# EAGLE design PL-100 (EAGLE 7.6.0)
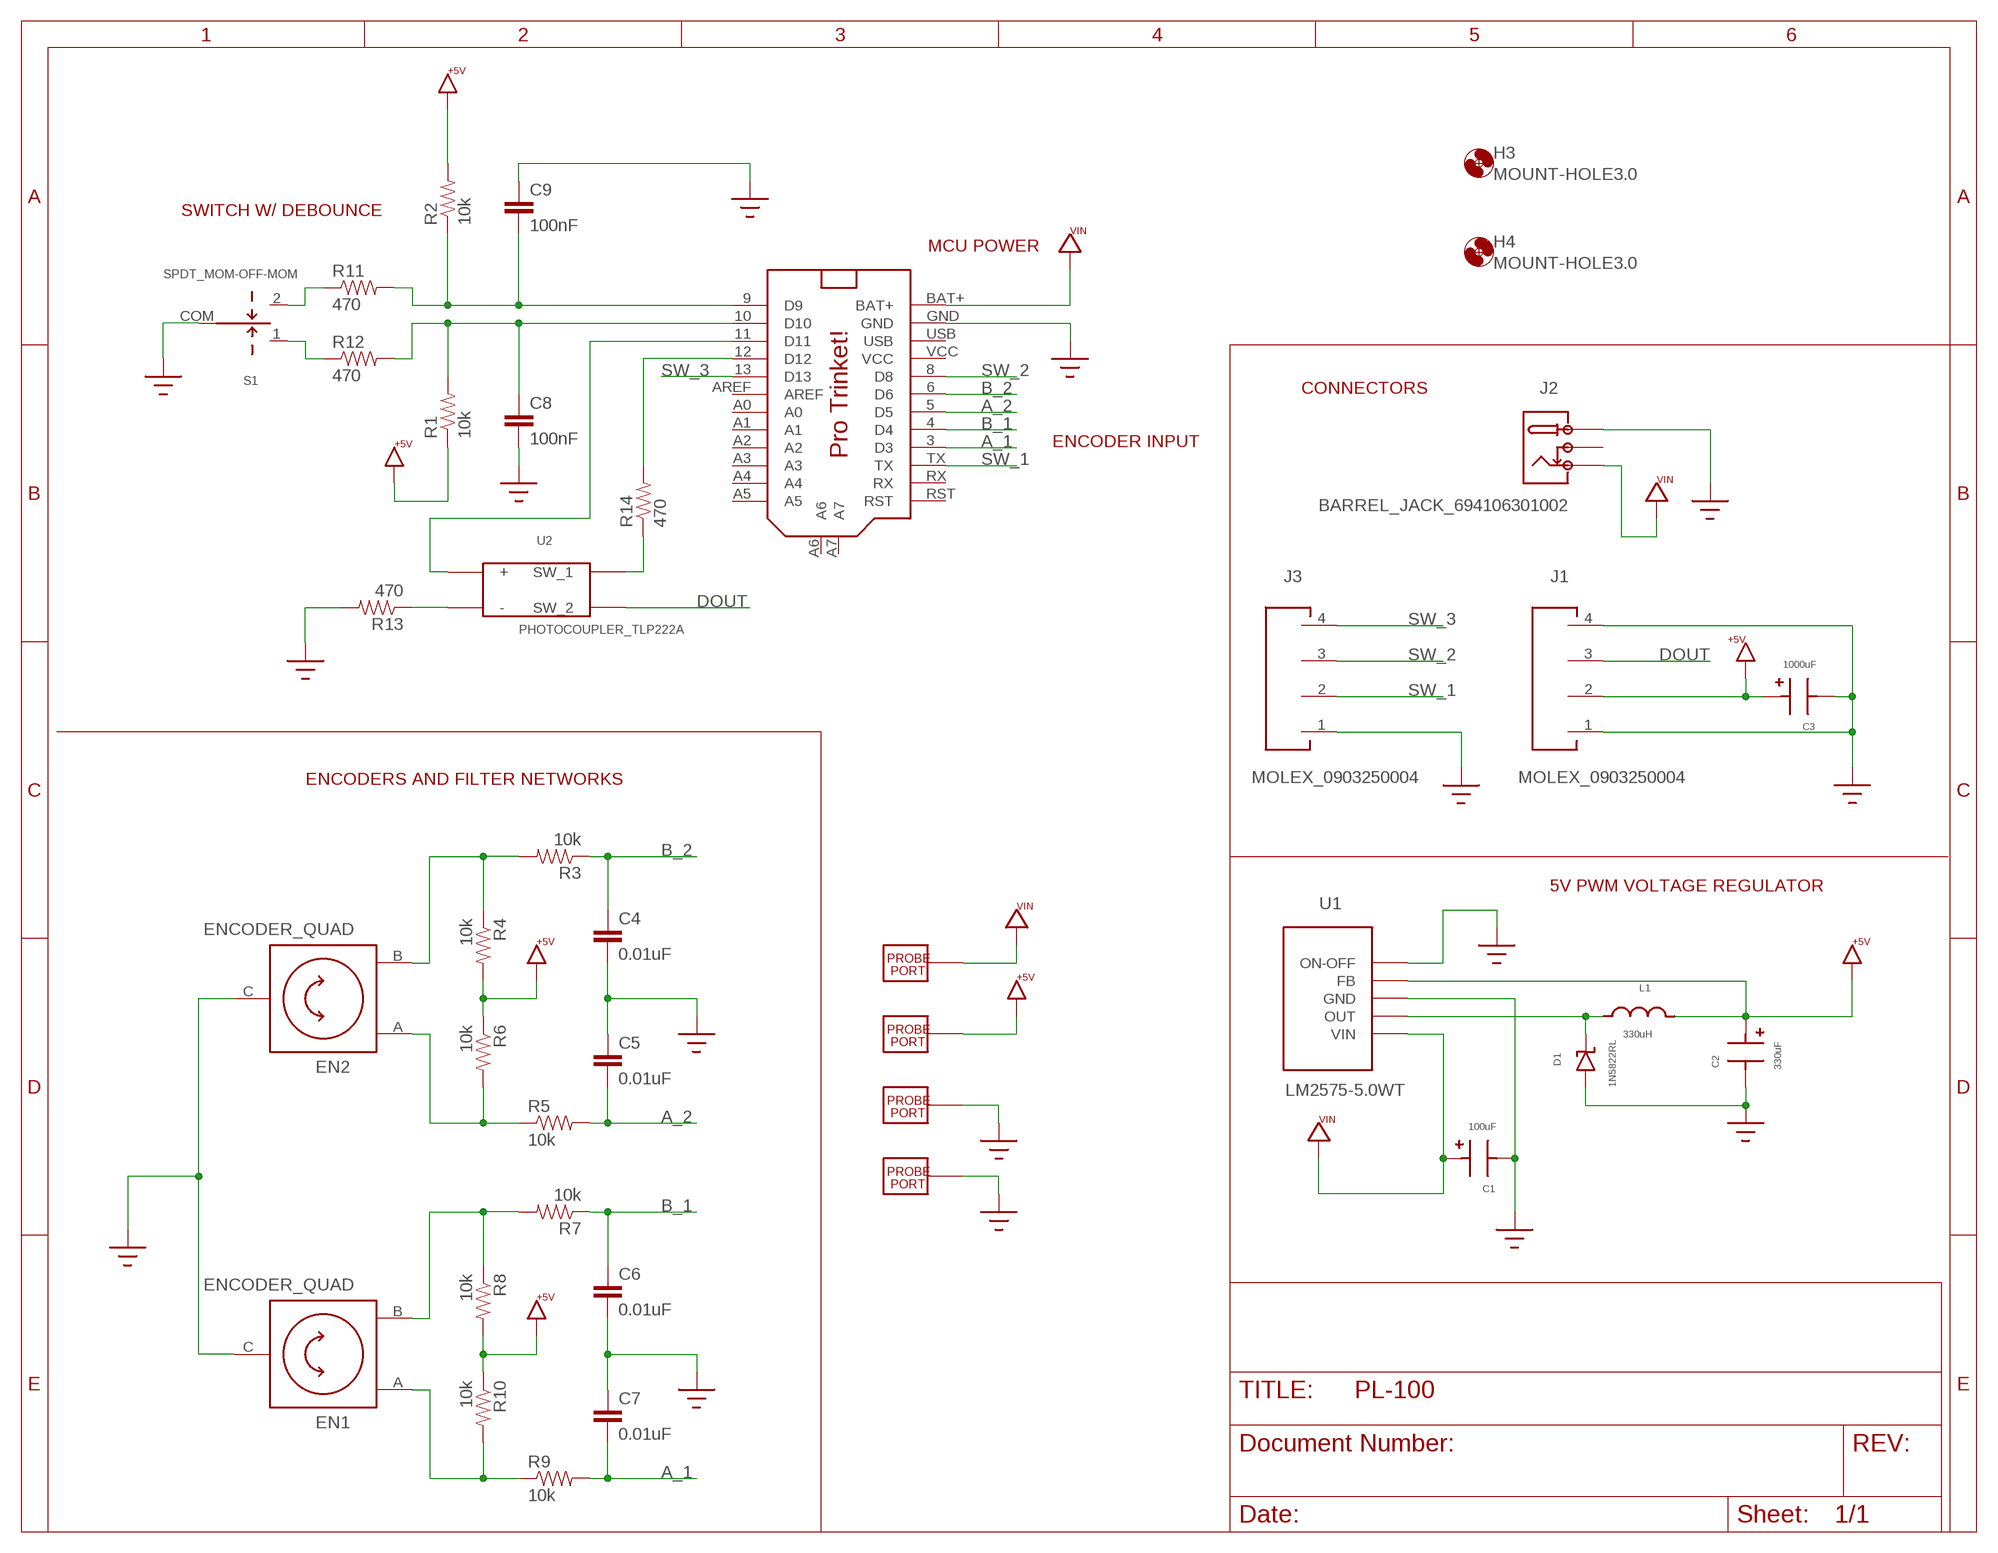
[diagram p0: schematic, sheet 1]

## Parts
+5V  PROBE_PORT  [PROBE_PORT]
C1  100uF  CAP_POL6.3-DIA_2.5-SPACE  [RADIAL_POL_6.3-DIA_2.5-SPACE]
C2  330uF  CAP_POL8-DIA_3.5-SPACE  [RADIAL_POL_8-DIA_3.5-SPACE]
C3  1000uF  CAP_POL10-DIA_5-SPACE  [RADIAL_POL_10-DIA_5-SPACE]
C4  0.01uF  CAPEZ  [CAP-PTH-SMALLEZ]
C5  0.01uF  CAPEZ  [CAP-PTH-SMALLEZ]
C6  0.01uF  CAPEZ  [CAP-PTH-SMALLEZ]
C7  0.01uF  CAPEZ  [CAP-PTH-SMALLEZ]
C8  100nF  CAPPTH  [CAP-PTH-SMALL]
C9  100nF  CAPPTH  [CAP-PTH-SMALL]
D1  1N5822RL  DIODE_SHOTTKY  [DO-201AD_AXIAL]
EN1  ENCODER_QUAD  [PEC11R-4015F-N0024]
EN2  ENCODER_QUAD  [PEC11R-4015F-N0024]
GND1  PROBE_PORT  [PROBE_PORT]
GND2  PROBE_PORT  [PROBE_PORT]
H3  MOUNT-HOLE3.0  [3,0]
H4  MOUNT-HOLE3.0  [3,0]
J1  MOLEX_0903250004  [0903250004]
J2  BARREL_JACK_694106301002  [BARREL_JACK_694106301002]
J3  MOLEX_0903250004  [0903250004]
L1  330uH  INDUCTOR  [INDUCT_AXIAL_28-SPACING]
R1  10k  RESISTORPTH-1/4W  [AXIAL-0.4]
R2  10k  RESISTORPTH-1/4W  [AXIAL-0.4]
R3  10k  RESISTORPTH-1/4W  [AXIAL-0.4]
R4  10k  RESISTORPTH-1/4W  [AXIAL-0.4]
R5  10k  RESISTORPTH-1/4W  [AXIAL-0.4]
R6  10k  RESISTORPTH-1/4W  [AXIAL-0.4]
R7  10k  RESISTORPTH-1/4W  [AXIAL-0.4]
R8  10k  RESISTORPTH-1/4W  [AXIAL-0.4]
R9  10k  RESISTORPTH-1/4W  [AXIAL-0.4]
R10  10k  RESISTORPTH-1/4W  [AXIAL-0.4]
R11  470  RESISTORPTH-1/4W  [AXIAL-0.4]
R12  470  RESISTORPTH-1/4W  [AXIAL-0.4]
R13  470  RESISTORPTH-1/4W  [AXIAL-0.4]
R14  470  RESISTORPTH-1/4W  [AXIAL-0.4]
S1  SPDT_MOM-OFF-MOM  [100SP4T6B11M2QEH]
U1  LM2575-5.0WT  [TO-220-5]
U2  PHOTOCOUPLER_TLP222A  [DIP-4]
U$2  PRO_TRINKET  [PROTRINKET]
VIN  PROBE_PORT  [PROBE_PORT]

## Nets
+5V: +5V.P$1 C2.+ C3.+ J1.2 L1.2 R1.P$1 R2.P$2 R4.P$2 R6.P$1 R8.P$2 R10.P$1 U1.4(FB)
A_1: C7.2 R9.P$2 U$2.3(D3)
A_2: C5.2 R5.P$2 U$2.5(D5)
B_1: C6.1 R7.P$1 U$2.4(D4)
B_2: C4.1 R3.P$1 U$2.6(D6)
DOUT: J1.3 U2.4(SW_2)
GND: C1.- C2.- C3.- C4.2 C5.1 C6.2 C7.1 C8.2 C9.1 D1.+ EN1.C EN2.C GND1.P$1 GND2.P$1 J1.1 J1.4 J2.1 J3.1 R13.P$2 S1.COM U1.3(GND) U1.5(ON-OFF) U$2.GND
N$1: D1.- L1.1 U1.2(OUT)
N$2: C9.2 R2.P$1 R11.P$2 U$2.9(D9)
N$3: C8.1 R1.P$2 R12.P$2 U$2.10(D10)
N$4: EN2.B R3.P$2 R4.P$1
N$5: EN2.A R5.P$1 R6.P$2
N$6: EN1.B R7.P$2 R8.P$1
N$7: EN1.A R9.P$1 R10.P$2
N$8: R11.P$1 S1.2(MOM_2)
N$9: R12.P$1 S1.1(MOM_1)
N$10: R13.P$1 U2.2(-)
N$11: R14.P$2 U$2.12(D12)
N$12: R14.P$1 U2.3(SW_1)
N$13: U2.1(+) U$2.11(D11)
SW_1: J3.2 U$2.TX
SW_2: J3.3 U$2.8(D8)
SW_3: J3.4 U$2.13(D13)
VIN: C1.+ J2.2 U1.1(VIN) U$2.BAT+ VIN.P$1
Unconnected: U$2.A0 U$2.A1 U$2.A2 U$2.A3 U$2.A4 U$2.A5 U$2.A6 U$2.A7 U$2.AREF U$2.RST U$2.RX

## Notes on the sheet
- SWITCH W/ DEBOUNCE
- MCU POWER
- CONNECTORS
- ENCODER INPUT
- ENCODERS AND FILTER NETWORKS
- 5V PWM VOLTAGE REGULATOR

## Power pins joined to a net without a drawn wire
3: J2.3
USB: U$2.USB
VCC: U$2.VCC

## Library data of the parts
+5V GND1 GND2 VIN = TinkerTech:PROBE_PORT
C1-C3 = TinkerTech:CAP_POL
C4-C9 = SparkFun-Passives:CAP: Capacitor Standard 0603 ceramic capacitor, and 0.1" leaded capacitor.
D1 = TinkerTech:DIODE_SHOTTKY
EN1 EN2 = TinkerTech:ENCODER_QUAD
H3 H4 = holes:MOUNT-HOLE: MOUNTING HOLE with drill center marker
J1 J3 = TinkerTech:MOLEX_0903250004
J2 = TinkerTech:BARREL_JACK_694106301002
L1 = TinkerTech:INDUCTOR
R1-R14 = SparkFun-Passives:RESISTOR: Resistor Basic schematic elements and footprints for 0603, 1206, and PTH resistors.
S1 = TinkerTech:SPDT_MOM-OFF-MOM
U1 = TinkerTech:LM2575
U2 = TinkerTech:PHOTOCOUPLER_TLP222A
U$2 = TinkerTech:PRO_TRINKET

## Board
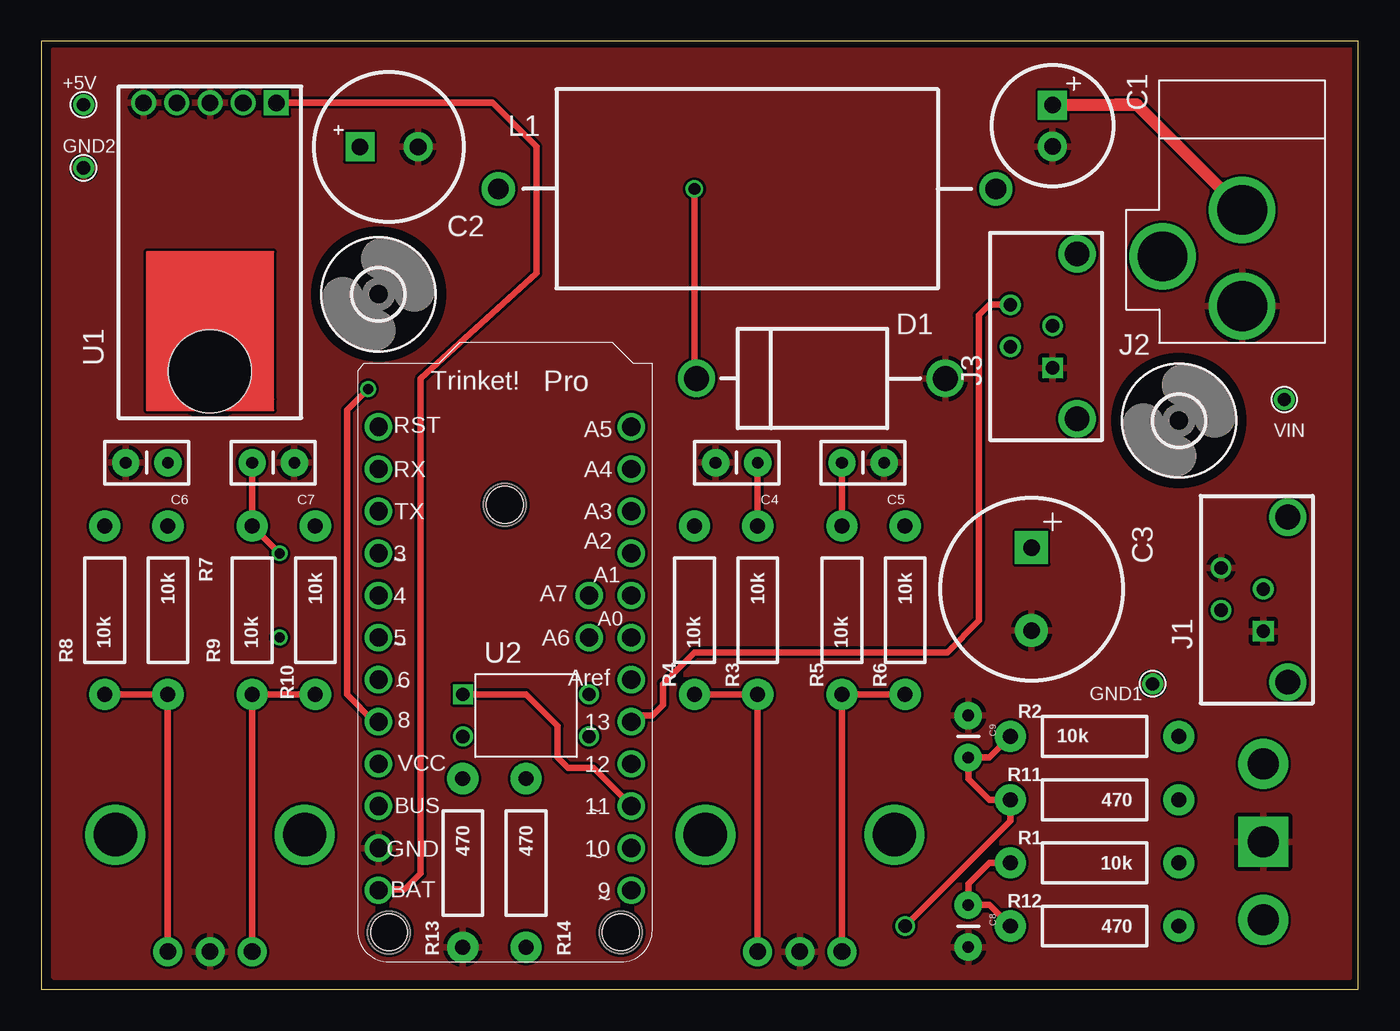
[diagram p1: board, top side]
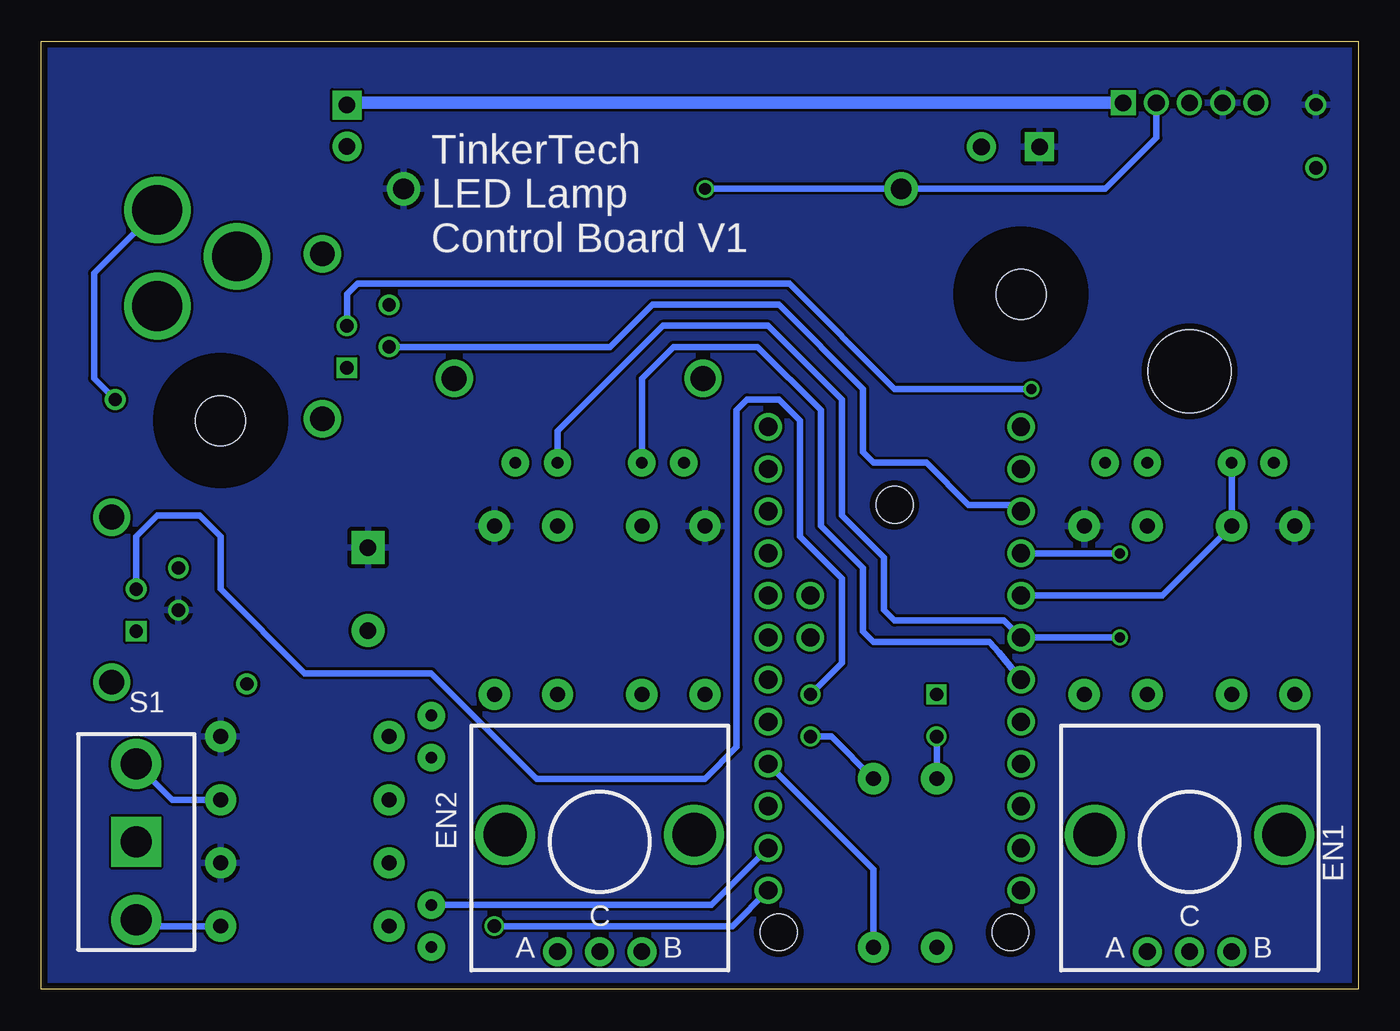
[diagram p2: board, bottom side, seen from below]

Size 79.38 x 57.15 mm. Coordinates in mm from the lower left corner, seen from the top.
Outline: 0,0 79.38,0 79.38,57.15 0,57.15 0,0
Copper layers (1*16): Top 0.0356mm / dielectric 1.5011mm / Bottom 0.0356mm
Design rules "oshpark-2layer": minimum track width 6mil, minimum drill 13mil, track to track 6mil, track to pad 6mil, pad to pad 6mil, via to via 6mil, smd to smd 6mil, copper to edge 15mil, drill to drill 6mil, minimum pad ring 7mil, minimum via ring 7mil, stop-mask expansion 2.5mil, vias tented up to drill 0mil, thermal gap 10mil

### Footprints (pad centres in the part's own frame; a part is rotated, then mirrored left to right if it is on the bottom)
PROBE_PORT = drill 0.8 pad 1.27: P$1 0,0
RADIAL_POL_6.3-DIA_2.5-SPACE = drill 1 pad 1.75 square: + -1.25,0 | drill 1 pad 1.75: - 1.25,0
RADIAL_POL_8-DIA_3.5-SPACE = drill 1 pad 1.75 square: + -1.75,0 | drill 1 pad 1.75: - 1.75,0
RADIAL_POL_10-DIA_5-SPACE = drill 1 pad 2 square: + -2.5,0 | drill 1 pad 2: - 2.5,0
CAP-PTH-SMALLEZ = drill 0.7 pad 1.651: 1 0,0; 2 2.54,0
CAP-PTH-SMALL = drill 0.7 pad 1.651: 1 0,0; 2 2.54,0
DO-201AD_AXIAL = drill 1.5 pad 2.25: + -7.5,0; - 7.5,0
PEC11R-4015F-N0024 = drill 2.6 pad 3.5: 4 5.7,0.435; 5 -5.7,0.435 | drill 1 pad 1.75: A -2.54,-6.625; B 2.54,-6.625; C 0,-6.625
3,0 = hole 3: 0,0
0903250004 = drill 0.8 pad 1.25 square: 1 -1.905,-1.27 | drill 0.8 pad 1.25: 2 -0.635,1.27; 3 0.635,-1.27; 4 1.905,1.27 | drill 1.5 pad 2.25: 5 -4.975,-2.75; 6 4.975,-2.75
BARREL_JACK_694106301002 = drill 3: 1 5.8,0; 2 0,0; 3 2.8,-4.8
INDUCT_AXIAL_28-SPACING = drill 1.25 pad 2: 1 -15,0; 2 15,0
AXIAL-0.4 = drill 0.9 pad 1.88: P$1 -5.08,0; P$2 5.08,0
100SP4T6B11M2QEH = drill 1.85 pad 3: 1 -4.7,0; 2 4.7,0 | drill 1.85 pad 3 square: COM 0,0
TO-220-5 = drill 1 pad 1.5 square: 1 -4,-9 | drill 1 pad 1.5: 2 -2,-9; 3 0,-9; 4 2,-9; 5 4,-9 | hole 5: 0,7.2
DIP-4 = drill 0.8 square: 1 -1.27,-3.8 | drill 0.8: 2 1.27,-3.8; 3 1.27,3.8; 4 -1.27,3.8
PROTRINKET = drill 1.1: 3 7.62,2.921; 4 7.62,5.461; 5 7.62,8.001; 6 7.62,10.541; 8 7.62,13.081; 9 -7.62,23.241; 10 -7.62,20.701; 11 -7.62,18.161; 12 -7.62,15.621; 13 -7.62,13.081; A0 -7.62,8.001; A1 -7.62,5.461; A2 -7.62,2.921; A3 -7.62,0.381; A4 -7.62,-2.159; A5 -7.62,-4.699; A6 -5.08,8.001; A7 -5.08,5.461; AREF -7.62,10.541; BAT+ 7.62,23.241; GND 7.62,20.701; RST 7.62,-4.699; RX 7.62,-2.159; TX 7.62,0.381; USB 7.62,18.161; VCC 7.62,15.621 | hole 2.2: -6.985,25.781; 6.985,25.781; 0,0

### Placement (x,y rotation side)
+5V  2.54,53.34 0 top
C1  60.96,52.07 270 top
C2  20.95,50.8 0 top
C3  59.69,24.13 270 top
C4  43.18,31.75 180 top
C5  50.8,31.75 180 top
C6  7.62,31.75 180 top
C7  15.24,31.75 180 top
C8  55.88,5.08 270 top
C9  55.88,16.51 270 top
D1  46.99,36.83 180 top
EN1  10.16,8.89 0 bottom
EN2  45.72,8.89 0 bottom
GND1  66.99,18.41 0 top
GND2  2.54,49.53 0 top
H3  68.58,34.29 0 top
H4  20.32,41.91 0 top
J1  72.39,23.5 90 top
J2  72.39,46.99 270 top
J3  59.69,39.37 90 top
L1  42.55,48.26 0 top
R1  63.5,7.62 180 top
R2  63.5,15.24 0 top
R3  43.18,22.86 270 top
R4  39.37,22.86 90 top
R5  48.26,22.86 90 top
R6  52.07,22.86 270 top
R7  7.62,22.86 270 top
R8  3.81,22.86 90 top
R9  12.7,22.86 90 top
R10  16.51,22.86 270 top
R11  63.5,11.43 180 top
R12  63.5,3.81 180 top
R13  25.4,7.62 270 top
R14  29.21,7.62 270 top
S1  73.66,8.89 90 bottom
U1  10.16,44.45 180 top
U2  29.21,16.51 270 top
U$2  27.94,29.21 180 top
VIN  74.93,35.56 0 top

### Tracks (layer width: path | path; a pad name or v marks a point on that pad's centre or on a via)
+5V
  pour Bottom: 0.51,0.51 78.87,0.51 78.87,56.64 0.51,56.64
A_1  (via drill 0.6)
  Top 0.406: C7.2 R9.P$2 v14.35,26.29
  Bottom 0.406: U$2.3 v14.35,26.29
A_2  (via drill 0.6)
  Top 0.406: C5.2 R5.P$2
  Bottom 0.406: v14.35,21.21 U$2.5 21.34,22.23 27.94,22.23 28.57,22.86 28.57,26.04 31.11,28.57 31.11,35.56 35.56,40.01 41.91,40.01 48.26,33.66 C5.2
B_1
  Bottom 0.406: C6.1 R7.P$1 11.81,23.75 U$2.4
B_2
  Top 0.406: C4.1 R3.P$1
  Bottom 0.406: U$2.6 21.65,20.32 22.23,20.95 29.21,20.95 29.84,21.59 29.84,25.4 32.38,27.94 32.38,34.92 36.2,38.73 41.27,38.73 43.18,36.83 C4.1
DOUT
  Bottom 0.406: J1.3 73.66,27.3 72.39,28.57 69.85,28.57 68.58,27.3 68.58,24.13 63.5,19.05 55.88,19.05 49.53,12.7 39.37,12.7 37.47,14.61 37.47,34.92 36.83,35.56 34.92,35.56 33.66,34.29 33.66,27.3 31.11,24.77 31.11,19.68 U2.4
GND
  pour Top: 0.76,0.76 78.87,0.76 78.87,56.64 0.76,56.64
N$1  (via drill 0.7)
  Top 0.406: v39.37,48.26 39.37,36.95 D1.-
  Bottom 0.406: v39.37,48.26 L1.1 15.24,48.26 12.16,51.34 U1.2
N$2  (via drill 0.8)
  Top 0.406: R2.P$1 57.15,13.97 C9.2 55.88,12.7 57.15,11.43 R11.P$2 58.42,10.16 v52.07,3.81
  Bottom 0.406: U$2.9 37.72,3.81 v52.07,3.81
N$3
  Top 0.406: R12.P$2 57.15,5.08 C8.1 55.88,6.35 57.15,7.62 R1.P$2
  Bottom 0.406: U$2.10 38.99,5.08 C8.1
N$4
  Top 0.406: EN2.B R3.P$2 R4.P$1
N$5
  Top 0.406: EN2.A R5.P$1 R6.P$2
N$6
  Top 0.406: EN1.B R7.P$2 R8.P$1
N$7
  Top 0.406: EN1.A R9.P$1 R10.P$2
N$8
  Bottom 0.406: S1.2 71.5,11.43 R11.P$1
N$9
  Bottom 0.406: S1.1 73.28,3.81 R12.P$1
N$10
  Bottom 0.406: U2.2 R13.P$1
N$11
  Bottom 0.406: R14.P$2 29.21,7.24 U$2.12
N$12
  Bottom 0.406: U2.3 31.75,15.24 R14.P$1
N$13
  Top 0.406: U$2.11 33.27,13.34 31.75,13.34 31.11,13.97 31.11,15.88 29.21,17.78 U2.1
SW_1
  Bottom 0.406: J3.2 45.09,38.73 42.55,41.27 34.92,41.27 29.84,36.2 29.84,32.38 29.21,31.75 26.04,31.75 23.5,29.21 20.7,29.21 U$2.TX
SW_2  (via drill 0.6)
  Top 0.406: U$2.8 20.07,16.13 18.41,17.78 18.41,34.92 v19.68,36.2
  Bottom 0.406: v19.68,36.2 27.94,36.2 34.29,42.55 60.33,42.55 60.96,41.91 J3.3
SW_3
  Top 0.406: J3.4 57.15,41.27 56.52,40.64 56.52,22.23 54.61,20.32 39.37,20.32 37.47,18.41 37.47,17.14 36.83,16.51 35.94,16.51 U$2.13
VIN
  Top 0.406: U1.1 27.2,53.45 29.84,50.8 29.84,43.18 22.86,36.83 22.86,6.99 21.91,6.03 20.38,6.03 U$2.BAT+
  Top 0.762: C1.+ 64.77,53.34 66.04,53.34 J2.2
  Bottom 0.406: J2.2 76.2,43.18 76.2,36.83 VIN.P$1 | C1.+ 60.83,53.45
  Bottom 0.762: 60.83,53.45 U1.1

### Text on the board
bPlace: TinkerTech / LED Lamp / Control Board V1